# EAGLE design SimuRain_v3.0_SoK (EAGLE 9.4.2)
CHECKED: 5/06/2019; COMPANY: NeKuNeKo Inc. Github: @nekuneko; DATE: $DATE; DRAWN: 1; DRGNO: 1993; REV: 3.0
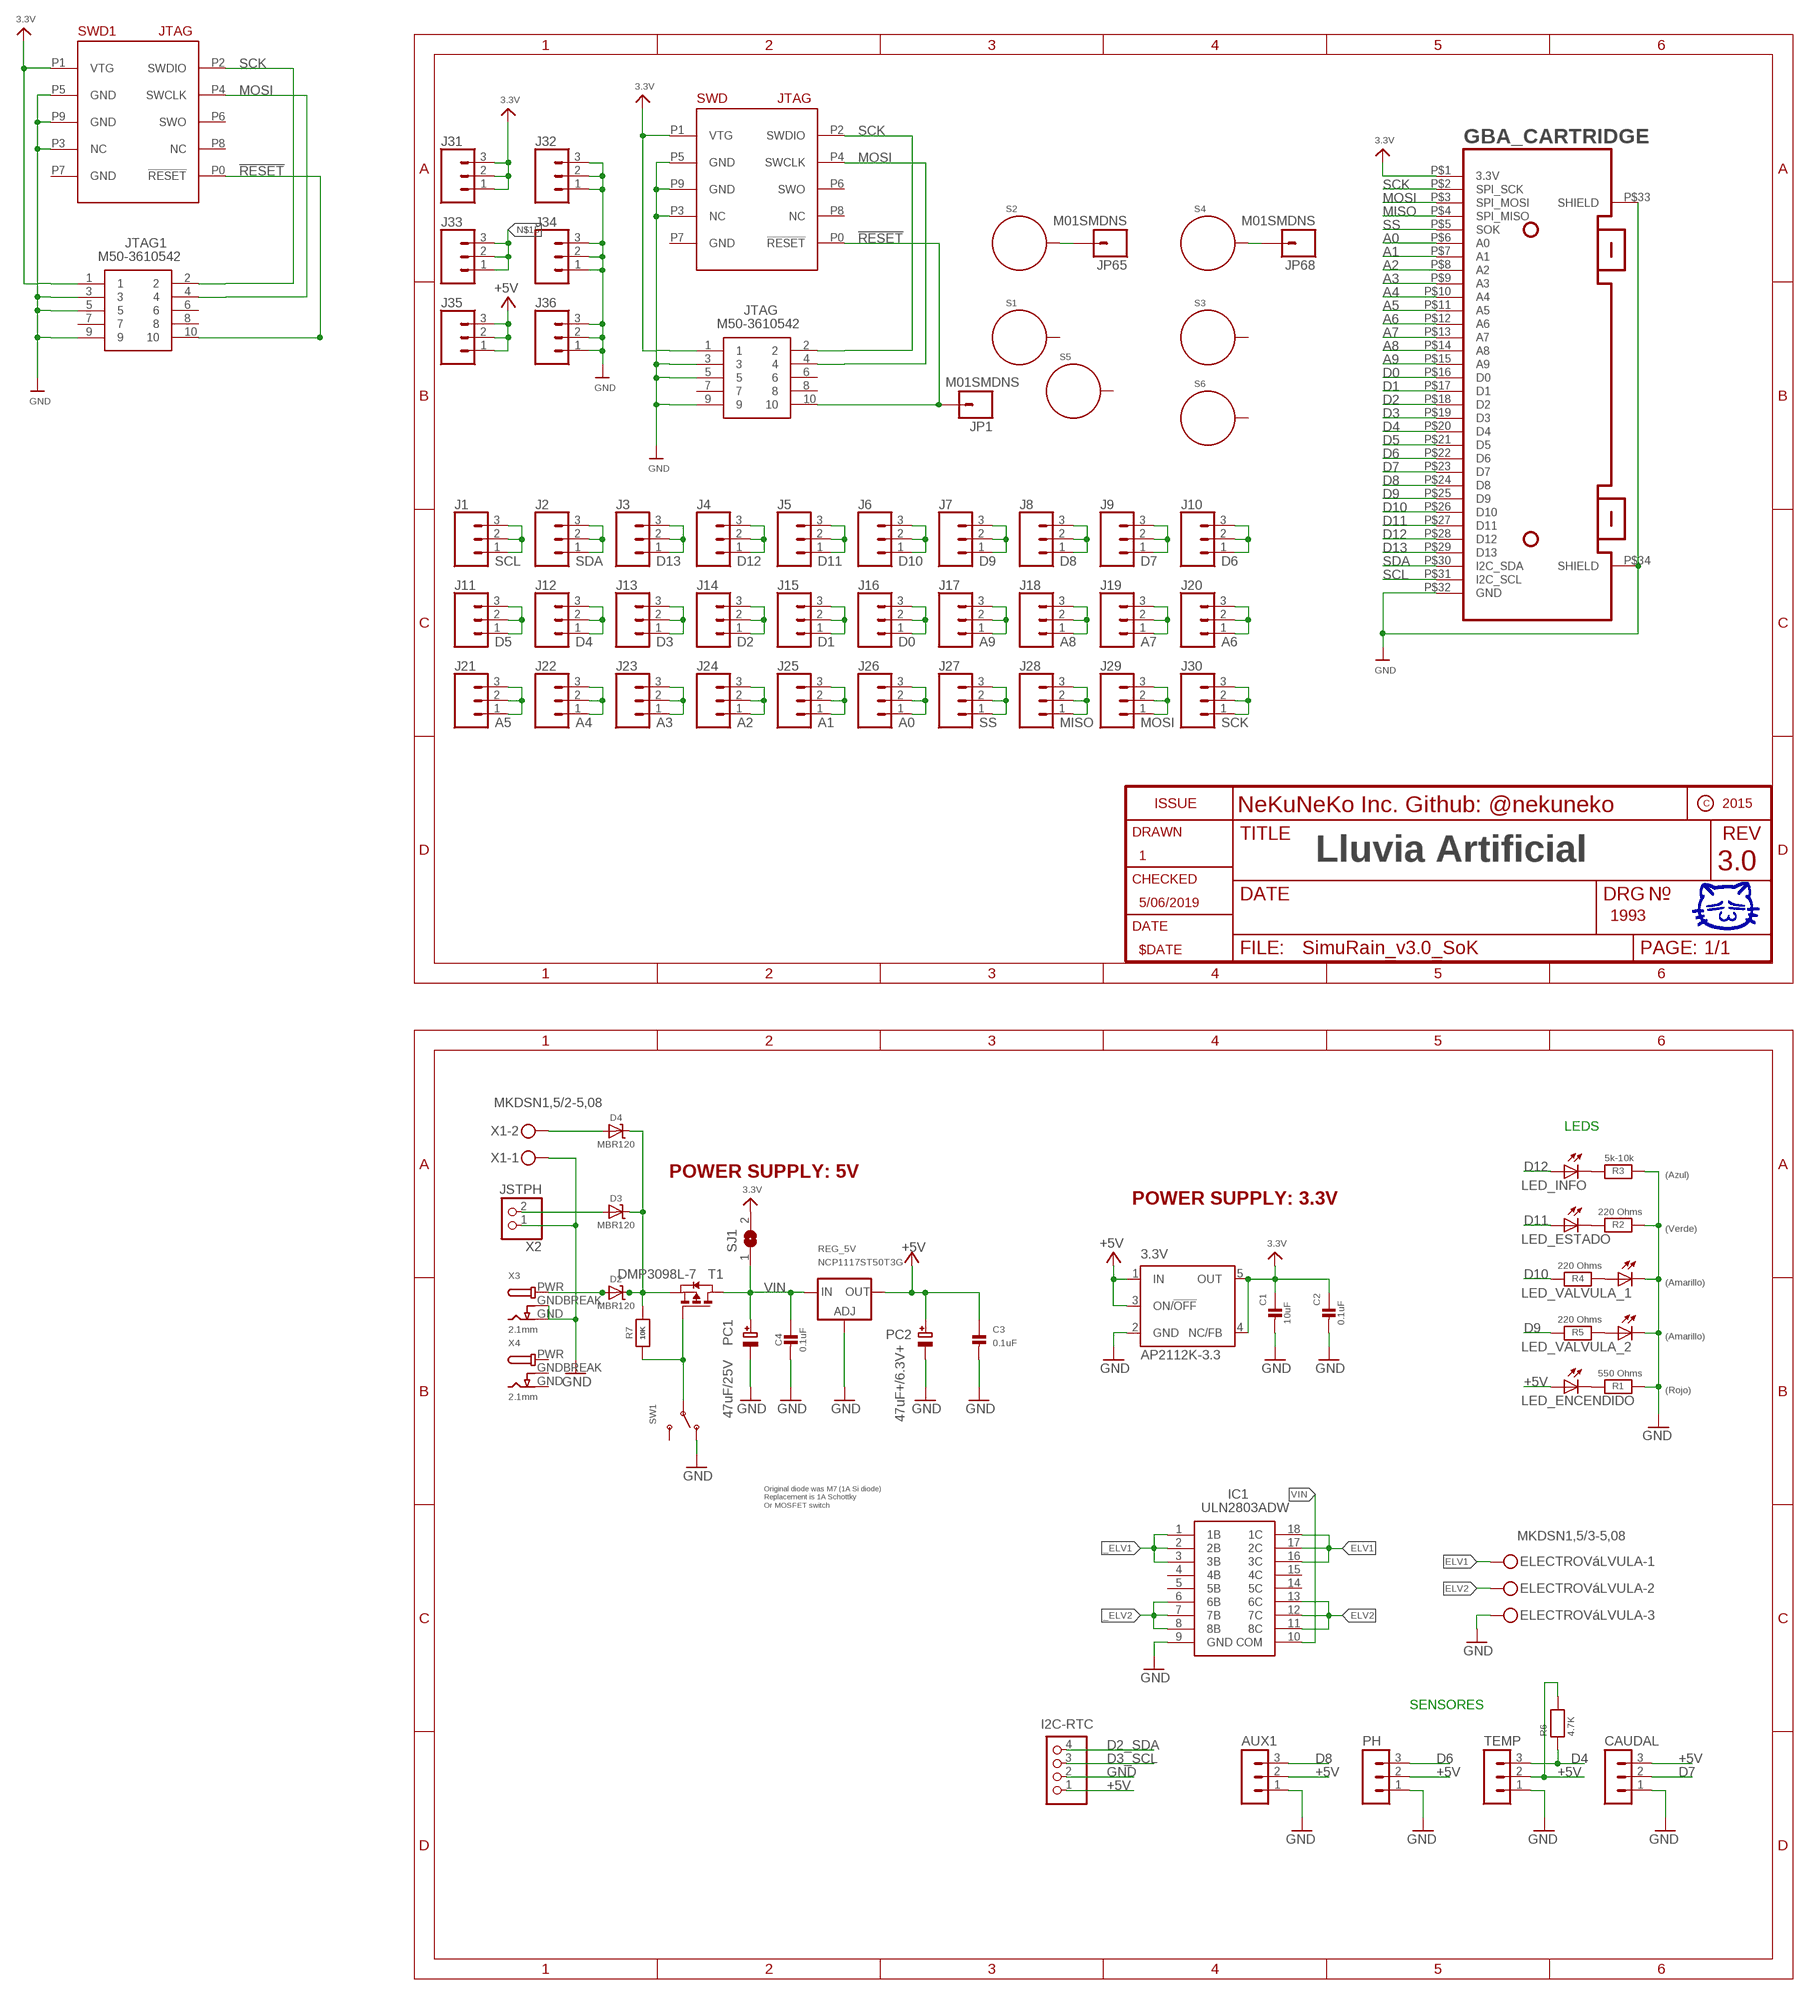
[diagram p0: schematic, sheet 1]

## Parts
3.3V  AP2112K-3.3  LP2985-XXDBVR33  [SOT23-DBV]
AUX1  MA03-1  [MA03-1]
C1  10uF  CAP_CERAMIC_0603  [_0603]
C2  0.1uF  CAP_CERAMIC_0603  [_0603]
C3  0.1uF  CAP_CERAMIC_0603  [_0603]
C4  0.1uF  CAP_CERAMIC_0603  [_0603]
CAUDAL  MA03-1  [MA03-1]
D2  MBR120  DIODE-SCHOTTKYSOD-123  [SOD-123]
D3  MBR120  DIODE-SCHOTTKYSOD-123  [SOD-123]
D4  MBR120  DIODE-SCHOTTKYSOD-123  [SOD-123]
ELECTROVáLVULA  MKDSN1,5/3-5,08  [MKDSN1,5/3-5,08]
GBA_CARTRIDGE  GBA_CARTRIDGEGBA_CARTRIDGE2  [GBA_CARTRIDGE2]
I2C-RTC  HEADER-1X4  [1X04_OVAL]
IC1  ULN2803ADW  [SOIC127P1030X265-18N]
J1  CONN_031X03_NO_SILK  [1X03_NO_SILK]
J2  CONN_031X03_NO_SILK  [1X03_NO_SILK]
J3  CONN_031X03_NO_SILK  [1X03_NO_SILK]
J4  CONN_031X03_NO_SILK  [1X03_NO_SILK]
J5  CONN_031X03_NO_SILK  [1X03_NO_SILK]
J6  CONN_031X03_NO_SILK  [1X03_NO_SILK]
J7  CONN_031X03_NO_SILK  [1X03_NO_SILK]
J8  CONN_031X03_NO_SILK  [1X03_NO_SILK]
J9  CONN_031X03_NO_SILK  [1X03_NO_SILK]
J10  CONN_031X03_NO_SILK  [1X03_NO_SILK]
J11  CONN_031X03_NO_SILK  [1X03_NO_SILK]
J12  CONN_031X03_NO_SILK  [1X03_NO_SILK]
J13  CONN_031X03_NO_SILK  [1X03_NO_SILK]
J14  CONN_031X03_NO_SILK  [1X03_NO_SILK]
J15  CONN_031X03_NO_SILK  [1X03_NO_SILK]
J16  CONN_031X03_NO_SILK  [1X03_NO_SILK]
J17  CONN_031X03_NO_SILK  [1X03_NO_SILK]
J18  CONN_031X03_NO_SILK  [1X03_NO_SILK]
J19  CONN_031X03_NO_SILK  [1X03_NO_SILK]
J20  CONN_031X03_NO_SILK  [1X03_NO_SILK]
J21  CONN_031X03_NO_SILK  [1X03_NO_SILK]
J22  CONN_031X03_NO_SILK  [1X03_NO_SILK]
J23  CONN_031X03_NO_SILK  [1X03_NO_SILK]
J24  CONN_031X03_NO_SILK  [1X03_NO_SILK]
J25  CONN_031X03_NO_SILK  [1X03_NO_SILK]
J26  CONN_031X03_NO_SILK  [1X03_NO_SILK]
J27  CONN_031X03_NO_SILK  [1X03_NO_SILK]
J28  CONN_031X03_NO_SILK  [1X03_NO_SILK]
J29  CONN_031X03_NO_SILK  [1X03_NO_SILK]
J30  CONN_031X03_NO_SILK  [1X03_NO_SILK]
J31  CONN_031X03_NO_SILK  [1X03_NO_SILK]
J32  CONN_031X03_NO_SILK  [1X03_NO_SILK]
J33  CONN_031X03_NO_SILK  [1X03_NO_SILK]
J34  CONN_031X03_NO_SILK  [1X03_NO_SILK]
J35  CONN_031X03_NO_SILK  [1X03_NO_SILK]
J36  CONN_031X03_NO_SILK  [1X03_NO_SILK]
JP1  M01SMDNS  [1X01NS]
JP65  M01SMDNS  [1X01NS]
JP68  M01SMDNS  [1X01NS]
JTAG  M50-3610542  [M503610542]
JTAG1  M50-3610542  [M503610542]
LED_ENCENDIDO  LED5MM  [LED5MM]
LED_ESTADO  LED5MM  [LED5MM]
LED_INFO  LED5MM  [LED5MM]
LED_VALVULA_1  LED5MM  [LED5MM]
LED_VALVULA_2  LED5MM  [LED5MM]
PC1  47uF/25V  CAP_ELECTROLYTICPANASONIC_D  [PANASONIC_D]
PC2  47uF+/6.3V+  CAP_ELECTROLYTICPANASONIC_D  [PANASONIC_D]
PH  MA03-1  [MA03-1]
R1  550 Ohms  RESISTOR_0805  [_0805]
R2  220 Ohms  RESISTOR_0805  [_0805]
R3  5k-10k  RESISTOR_0805  [_0805]
R4  220 Ohms  RESISTOR_0805  [_0805]
R5  220 Ohms  RESISTOR_0805  [_0805]
R6  4.7K  RESISTOR_0805  [_0805]
R7  10K  RESISTOR_0805  [_0805]
REG_5V  NCP1117ST50T3G  LM1117SOT223-REFLOW  [SOT223-R]
S1  STANDOFF_ELECTRICAL  [STANDOFF-ELECTRICAL]
S2  STANDOFF_ELECTRICAL  [STANDOFF-ELECTRICAL]
S3  STANDOFF_ELECTRICAL  [STANDOFF-ELECTRICAL]
S4  STANDOFF_ELECTRICAL  [STANDOFF-ELECTRICAL]
S5  STANDOFF_ELECTRICAL  [STANDOFF-ELECTRICAL]
S6  STANDOFF_ELECTRICAL  [STANDOFF-ELECTRICAL]
SJ1  SOLDERJUMPERREFLOW_NOPASTE  [SOLDERJUMPER_REFLOW_NOPASTE]
SW1  SWITCH_SPDT  [SPDT_SMT_SSSS811101]
SWD  JTAGICE3-CONNECTOR50MIL-THT  [JTAGICE3-50MIL]
SWD1  JTAGICE3-CONNECTOR50MIL-THT  [JTAGICE3-50MIL]
T1  DMP3098L-7  PMOSSOT23  [SOT-23]
TEMP  MA03-1  [MA03-1]
X1  MKDSN1,5/2-5,08  [MKDSN1,5/2-5,08]
X2  JSTPH  CON_JST_PH_2PIN  [JSTPH2]
X3  2.1mm  DCBARRELPTH  [DCJACK_2MM_PTH]
X4  2.1mm  DCBARRELPTH  [DCJACK_2MM_PTH]

## Nets
3.3V: 3.3V.4(NC/FB) 3.3V.5(OUT) C1.1 C2.1 GBA_CARTRIDGE.P$1(3.3V) J31.1 J31.2 J31.3 JTAG1.1 JTAG.1 SJ1.2 SWD1.P1(VTG) SWD.P1(VTG)
!RESET: JP1.1 JTAG1.10 JTAG.10 SWD1.P0(!RESET) SWD.P0(!RESET)
+5V [usbvcc]: 3.3V.1(IN) 3.3V.3(ON/!OFF) AUX1.2 C3.1 CAUDAL.3 I2C-RTC.1 J35.1 J35.2 J35.3 LED_ENCENDIDO.A PC2.+ PH.2 R6.2 REG_5V.2(OUT) REG_5V.4(OUT) TEMP.2
_ELV1: IC1.1(1B) IC1.2(2B) IC1.3(3B)
_ELV2: IC1.6(6B) IC1.7(7B) IC1.8(8B)
A0: GBA_CARTRIDGE.P$6(A0) J26.1 J26.2 J26.3
A1: GBA_CARTRIDGE.P$7(A1) J25.1 J25.2 J25.3
A2: GBA_CARTRIDGE.P$8(A2) J24.1 J24.2 J24.3
A3: GBA_CARTRIDGE.P$9(A3) J23.1 J23.2 J23.3
A4: GBA_CARTRIDGE.P$10(A4) J22.1 J22.2 J22.3
A5: GBA_CARTRIDGE.P$11(A5) J21.1 J21.2 J21.3
A6: GBA_CARTRIDGE.P$12(A6) J20.1 J20.2 J20.3
A7: GBA_CARTRIDGE.P$13(A7) J19.1 J19.2 J19.3
A8: GBA_CARTRIDGE.P$14(A8) J18.1 J18.2 J18.3
A9: GBA_CARTRIDGE.P$15(A9) J17.1 J17.2 J17.3
D0: GBA_CARTRIDGE.P$16(D0) J16.1 J16.2 J16.3
D1: GBA_CARTRIDGE.P$17(D1) J15.1 J15.2 J15.3
D2: GBA_CARTRIDGE.P$18(D2) J14.1 J14.2 J14.3
D2_SDA: I2C-RTC.4
D3: GBA_CARTRIDGE.P$19(D3) J13.1 J13.2 J13.3
D3_SCL: I2C-RTC.3
D4: GBA_CARTRIDGE.P$20(D4) J12.1 J12.2 J12.3 R6.1 TEMP.3
D5: GBA_CARTRIDGE.P$21(D5) J11.1 J11.2 J11.3
D6: GBA_CARTRIDGE.P$22(D6) J10.1 J10.2 J10.3 PH.3
D7: CAUDAL.2 GBA_CARTRIDGE.P$23(D7) J9.1 J9.2 J9.3
D8: AUX1.3 GBA_CARTRIDGE.P$24(D8) J8.1 J8.2 J8.3
D9: GBA_CARTRIDGE.P$25(D9) J7.1 J7.2 J7.3 R5.1
D10: GBA_CARTRIDGE.P$26(D10) J6.1 J6.2 J6.3 R4.1
D11: GBA_CARTRIDGE.P$27(D11) J5.1 J5.2 J5.3 LED_ESTADO.A
D12: GBA_CARTRIDGE.P$28(D12) J4.1 J4.2 J4.3 LED_INFO.A
D13: GBA_CARTRIDGE.P$29(D13) J3.1 J3.2 J3.3
ELV1: ELECTROVáLVULA.1 IC1.16(3C) IC1.17(2C) IC1.18(1C)
ELV2: ELECTROVáLVULA.2 IC1.11(8C) IC1.12(7C) IC1.13(6C)
GND: 3.3V.2(GND) AUX1.1 C1.2 C2.2 C3.2 C4.2 CAUDAL.1 ELECTROVáLVULA.3 GBA_CARTRIDGE.P$32(GND) GBA_CARTRIDGE.P$33(SHIELD) GBA_CARTRIDGE.P$34(SHIELD) I2C-RTC.2 IC1.9(GND) J32.1 J32.2 J32.3 J34.1 J34.2 J34.3 J36.1 J36.2 J36.3 JTAG1.3 JTAG1.5 JTAG1.9 JTAG.3 JTAG.5 JTAG.9 LED_VALVULA_1.K(C) LED_VALVULA_2.K(C) PC1.- PC2.- PH.1 R1.2 R2.2 R3.2 REG_5V.1(ADJ) SW1.A(O) SWD1.P3(NC) SWD1.P5(GND) SWD1.P9(GND) SWD.P3(NC) SWD.P5(GND) SWD.P9(GND) TEMP.1 X1.1 X2.1 X3.GND X3.GNDBREAK
MISO: GBA_CARTRIDGE.P$4(SPI_MISO) J28.1 J28.2 J28.3
MOSI: GBA_CARTRIDGE.P$3(SPI_MOSI) J29.1 J29.2 J29.3 JTAG1.4 JTAG.4 SWD1.P4(SWCLK) SWD.P4(SWCLK)
N$1: D4.A X1.2
N$2: D3.A X2.2
N$4: LED_ENCENDIDO.K(C) R1.1
N$5: LED_ESTADO.K(C) R2.1
N$6: LED_INFO.K(C) R3.1
N$7: LED_VALVULA_2.A R5.2
N$8: LED_VALVULA_1.A R4.2
N$15: D2.C D3.C D4.C J33.1 J33.2 J33.3 R7.2 T1.2(S)
N$65: JP65.1 S2.P1
N$68: JP68.1 S4.P1
PWR_SWITCH: R7.1 SW1.B(P) T1.3(G)
PWRIN [power]: D2.A X3.PWR
SCK: GBA_CARTRIDGE.P$2(SPI_SCK) J30.1 J30.2 J30.3 JTAG1.2 JTAG.2 SWD1.P2(SWDIO) SWD.P2(SWDIO)
SCL: GBA_CARTRIDGE.P$31(I2C_SCL) J1.1 J1.2 J1.3
SDA: GBA_CARTRIDGE.P$30(I2C_SDA) J2.1 J2.2 J2.3
SS: GBA_CARTRIDGE.P$5(SOK) J27.1 J27.2 J27.3
VIN: C4.1 IC1.10(COM) PC1.+ REG_5V.3(IN) SJ1.1 T1.1(D)
Unconnected: IC1.4(4B) IC1.5(5B) IC1.14(5C) IC1.15(4C) JTAG1.6 JTAG1.7 JTAG1.8 JTAG.6 JTAG.7 JTAG.8 S1.P1 S3.P1 S5.P1 S6.P1 SW1.C(S) SWD1.P6(SWO) SWD1.P7(GND) SWD1.P8(NC) SWD.P6(SWO) SWD.P7(GND) SWD.P8(NC)

## Notes on the sheet
- Lluvia Artificial
- LEDS
- POWER SUPPLY: 5V
- (Azul)
- POWER SUPPLY: 3.3V
- (Verde)
- (Amarillo)
- (Amarillo)
- (Rojo)
- Original diode was M7 (1A Si diode)
  Replacement is 1A Schottky
  Or MOSFET switch
- SENSORES

## Power pins joined to a net without a drawn wire
GND: X4.GND
GNDBREAK: X4.GNDBREAK
PWR: X4.PWR

## Library data of the parts
3.3V = SmartPrj:LP2985-XXDBVR: ULTRALOW-POWER 50-mA LOW-DROPOUT LINEAR REGULATORS 50-mA Low-Dropout Regulator Source: http://focus.ti.com/lit/ds/symlink/tps77001.pdf
AUX1 CAUDAL PH TEMP = con-lstb:MA03-1: PIN HEADER; OC_FARNELL: unknown; OC_NEWARK: unknown
C1-C4 = microbuilder:CAP_CERAMIC: Ceramic Capacitors 0402 - 0402 Surface Mount Capacitors 16pF 50V 5% [Digikey: 445-4899-2-ND] 18pF 50V 5% [Digikey: 490-1281-2-ND] 22pF 50V 5% [Digikey: 490-1283-2-ND] 68pF 50V 5% [Digikey: 490-1289-2-ND] 0.1uF 10V 10% [Digikey: 490-1318-2-ND] 1.0uF 6.3V 10% [Digikey: 490-1320-2-ND] 0603 - 0603 Surface Mount Capacitors 16 pF 50V 5% [Digikey: 445-5051-2-ND] 22 pF 50V [Digikey: PCC220ACVTR-ND] 33 pF 50V 5% [Digikey: 490-1415-1-ND] 56pF 50V 5% [Digikey: 490-1421-1-ND] 220pF 50V 5% [Digikey: 445-1285-1-ND] 680 pF 50V 2200 pF 50V 5% C0G [Digikey: 445-1297-1-ND] 5600 pF 100V 5% X7R [Digikey: 478-3711-1-ND] 0.1 µF 25V 10% [Digikey: PCC2277TR-ND] 0.22 µF 16V 10% X7R [Digikey: 445-1318-1-ND] 1.0 µF 25V 10% [Digikey: 445-5146-2-ND] 0603 - RF Specific 3pF 250V +/-0.1pF RF [Digikey: 712-1347-1-ND] 18 pF 250V 5% [Digikey: 478-3505-1-ND or 712-1322-1-ND] 56 pF 250V 5% C0G RF [Digikey: 490-4867-1-ND] 68 pF 250V RF [Digikey: 490-4868-1-ND] 0805 - 0805 Surface Mount Capacitors 220 pF 250V 2% RF Ceramic Capacitor [Digikey: 712-1398-1-ND] 1000 pF 50V 2% NP0 Ceramic Capacitor [Digikey: 478-3760-1-ND] 0.1 µF 25V 10% Ceramic Capacitor [Digikey: PCC1828TR-ND] 1.0 µF 16V 10% Ceramic Capacitor[Digikey: 490-1691-2-ND] 10.0 µF 10V 10% Ceramic Capacitor[Digikey: 709-1228-1-ND] 10.0 uF 16V 10% Ceramic Capacitor [Digikey: 478-5165-2-ND] 47 uF 6.3V 20% Ceramic Capacitor [Digikey: 587-1779-1-ND or 399-5506-1-ND] 1206 - 1206 Surface Mount Capacitors 47uF 10V 20% Ceramic Capacitor [Digikey: 490-5528-1-ND or 399-5508-1-ND or 445-6010-1-ND] 100uF 6.3V -20%, +80% Y5V Ceramic Capacitor (Digikey: 490-4512-1-ND, Mouser: 81-GRM31CF50J107ZE1L)
D2-D4 = microbuilder:DIODE-SCHOTTKY
ELECTROVáLVULA = con-phoenix-508:MKDSN1,5/3-5,08: MKDSN 1,5/ 3-5,08 Printklemme Nennstrom: 13,5 A Nennspannung: 250 V Rastermaß: 5,08 mm Polzahl: 3 Anschlussart: Schraubanschluss Montage: Löten Anschlussrichtung Leiter/Platine: 0 ° Artikelnummer: 1729131 Source: http://eshop.phoenixcontact.com .. 1729131.pdf
GBA_CARTRIDGE = 0SoK:GBA_CARTRIDGE: GBA Cartridge Slot for NDS - from Aliexpress Gontak SoK main interface
I2C-RTC = microbuilder:HEADER-1X4: PIN HEADER
IC1 = SamacSys_Parts:ULN2803ADW: ULN2803ADW, Darlington Transistor Array, NPN 0.5 A 50 V, Octal, 18-Pin, SOIC Source: Datasheet <http://docs-emea.rs-online.com/webdocs/139e/0900766b8139e021.pdf>; DESCRIPTION: ULN2803ADW, Darlington Transistor Array, NPN 0.5 A 50 V, Octal, 18-Pin, SOIC; HEIGHT: 2.65mm; MANUFACTURER_NAME: Texas Instruments; MANUFACTURER_PART_NUMBER: ULN2803ADW; MOUSER_PART_NUMBER: 595-ULN2803ADW; MOUSER_PRICE-STOCK: https://www.mouser.com/Search/Refine.aspx?Keyword=595-ULN2803ADW; RS_PART_NUMBER: 8660196; RS_PRICE-STOCK: http://uk.rs-online.com/web/p/products/8660196
J1-J36 = SparkFun-Connectors:CONN_03: Multi connection point. Often used as Generic Header-pin footprint for 0.1 inch spaced/style header connections On any of the 0.1 inch spaced packages, you can populate with these: Break Away Headers - Straight <https://www.sparkfun.com/products/116> (PRT-00116) Break Away Male Headers - Right Angle <https://www.sparkfun.com/products/553> (PRT-00553) Female Headers <https://www.sparkfun.com/products/115> (PRT-00115) Break Away Headers - Machine Pin <https://www.sparkfun.com/products/117> (PRT-00117) Break Away Female Headers - Swiss Machine Pin <https://www.sparkfun.com/products/743> (PRT-00743) Stackable Header - 3 Pin (Female, 0.1") <https://www.sparkfun.com/products/13875> (PRT-13875) For SCREWTERMINALS and SPRING TERMINALS visit here: Screw Terimnals on SparkFun.com <https://www.sparkfun.com/search/results?term=Screw+Terminals> (5mm/3.5mm/2.54mm spacing) This device is also useful as a general connection point to wire up your design to another part of your project. Our various solder wires solder well into these plated through hole pads. Hook-Up Wire - Assortment (Stranded, 22 AWG) <https://www.sparkfun.com/products/11375> (PRT-11375) Hook-Up Wire - Assortment (Solid Core, 22 AWG) <https://www.sparkfun.com/products/11367> (PRT-11367) View the entire wire category on our website here <https://www.sparkfun.com/categories/141> Special notes: Molex polarized connector foot print use with SKU : PRT-08232 with associated crimp pins and housings.
JP1 JP65 JP68 = SparkFun-Connectors:M01: Header 1 Standard 1-pin 0.1" header. Use with straight break away headers (SKU : PRT-00116), right angle break away headers (PRT-00553), swiss pins (PRT-00743), machine pins (PRT-00117), and female headers (PRT-00115).
JTAG JTAG1 = SamacSys_Parts:M50-3610542: HARWIN - M50-3610542 - CONNECTOR, HEADER, 10POS, 2ROW, 1.27MM Source: Datasheet <https://cdn.harwin.com/pdfs/M50-361.pdf>; DESCRIPTION: HARWIN - M50-3610542 - CONNECTOR, HEADER, 10POS, 2ROW, 1.27MM; HEIGHT: 5.03mm; MANUFACTURER_NAME: HARWIN; MANUFACTURER_PART_NUMBER: M50-3610542; MOUSER_PART_NUMBER: 855-M50-3610542; MOUSER_PRICE-STOCK: https://www.mouser.com/Search/Refine.aspx?Keyword=855-M50-3610542
LED_ENCENDIDO LED_ESTADO LED_INFO LED_VALVULA_1 LED_VALVULA_2 = led:LED: LED OSRAM: - CHIPLED LG R971, LG N971, LY N971, LG Q971, LY Q971, LO R971, LY R971 LH N974, LH R974 LS Q976, LO Q976, LY Q976 LO Q996 - Hyper CHIPLED LW Q18S LB Q993, LB Q99A, LB R99A - SideLED LS A670, LO A670, LY A670, LG A670, LP A670 LB A673, LV A673, LT A673, LW A673 LH A674 LY A675 LS A676, LA A676, LO A676, LY A676, LW A676 LS A679, LY A679, LG A679 - Hyper Micro SIDELED® LS Y876, LA Y876, LO Y876, LY Y876 LT Y87S - SmartLED LW L88C, LW L88S LB L89C, LB L89S, LG L890 LS L89K, LO L89K, LY L89K LS L896, LA L896, LO L896, LY L896 - TOPLED LS T670, LO T670, LY T670, LG T670, LP T670 LSG T670, LSP T670, LSY T670, LOP T670, LYG T670 LG T671, LOG T671, LSG T671 LB T673, LV T673, LT T673, LW T673 LH T674 LS T676, LA T676, LO T676, LY T676, LB T676, LH T676, LSB T676, LW T676 LB T67C, LV T67C, LT T67C, LS T67K, LO T67K, LY T67K, LW E67C LS E67B, LA E67B, LO E67B, LY E67B, LB E67C, LV E67C, LT E67C LW T67C LS T679, LY T679, LG T679 LS T770, LO T770, LY T770, LG T770, LP T770 LB T773, LV T773, LT T773, LW T773 LH T774 LS E675, LA E675, LY E675, LS T675 LS T776, LA T776, LO T776, LY T776, LB T776 LHGB T686 LT T68C, LB T68C - Hyper Mini TOPLED® LB M676 - Mini TOPLED Santana® LG M470 LS M47K, LO M47K, LY M47K Source: http://www.osram.convergy.de LUXEON: - LUMILED® LXK2-PW12-R00, LXK2-PW12-S00, LXK2-PW14-U00, LXK2-PW14-V00 LXK2-PM12-R00, LXK2-PM12-S00, LXK2-PM14-U00 LXK2-PE12-Q00, LXK2-PE12-R00, LXK2-PE12-S00, LXK2-PE14-T00, LXK2-PE14-U00 LXK2-PB12-K00, LXK2-PB12-L00, LXK2-PB12-M00, LXK2-PB14-N00, LXK2-PB14-P00, LXK2-PB14-Q00 LXK2-PR12-L00, LXK2-PR12-M00, LXK2-PR14-Q00, LXK2-PR14-R00 LXK2-PD12-Q00, LXK2-PD12-R00, LXK2-PD12-S00 LXK2-PH12-R00, LXK2-PH12-S00 LXK2-PL12-P00, LXK2-PL12-Q00, LXK2-PL12-R00 Source: www.luxeon.com KINGBRIGHT: KA-3528ASYC Source: www.kingbright.com
PC1 PC2 = microbuilder:CAP_ELECTROLYTIC: Electrolytic Capacitors SMT PANASONIC_C - Size C Panasonic Electrolytic Aluminum Capacitor 47µF 16V 20% Electrolytic Capacitor [Digikey: PCE3890TR-ND] PANASONIC_D - Size D Panasonic Electrolytic Aluminum Capacitor 100µF 25V 20% Electrolytic Capacitor [Digikey: PCE3898TR-ND] PTH 3.5 mm grid, 8 mm diameter ... 3.5 mm grid, 10 mm diameter ...
R1-R7 = microbuilder:RESISTOR: Resistors 0402 - 0402 Surface Mount Package 22 Ohm 1% 1/16W [Digikey: 311-22.0LRTR-ND] 33 Ohm 5% 1/16W 1.0K 5% 1/16W 1.5K 5% 1/16W 2.0K 1% 1/16W 10.0K 1% 1/16W [Digikey: 311-10.0KLRTR-ND] 10.0K 5% 1/16W [Digikey: RMCF0402JT10K0TR-ND] 12.1K 1% 1/16W [Digikey: 311-22.0LRTR-ND] 100.0K 5% 1/16W 0603 - 0603 Surface Mount Package 0 Ohm 1/10 Watt 1% Resistor 15 Ohm 1/10 Watt 1% Resistor 33 Ohm 1/10 Watt 1% Resistor 49.9 Ohm 1/10 Watt 1% Resistor 100 Ohm 1/10 Watt 1% Resistor 150 Ohm 1/10 Watt 1% Resistor 240 Ohm 1/10 Watt 1% Resistor 390 Ohm 1/10 Watt 1% Resistor 560 Ohm 1/10 Watt 1% Resistor 680 Ohm 1/10 Watt 1% Resistor 750 Ohm 1/10 Watt 1% Resistor 1.0K Ohm 1/10 Watt 1% Resistor 1.5K Ohm 1/10 Watt 1% Resistor 2.0K Ohm 1/10 Watt 1% Resistor 2.2K Ohm 1/10 Watt 1% Resistor 3.3K Ohm 1/10 Watt 1% Resistor 4.7K Ohm 1/10 Watt 1% Resistor 10.0K Ohm 1/10 Watt 1% Resistor 12.0K Ohm 1/10 Watt 1% Resistor 12.1K Ohm 1/10 Watt 1% Resistor 20.0K Ohm 1/10 Watt 1% Resistor 33.0K Ohm 1/10 Watt 1% Resistor 100.0K Ohm 1/10 Watt 1% Resistor 0805 - 0805 Surface Mount Package 0 Ohm 1/8 Watt 1% Resistor 33 Ohm 1/8 Watt 1% Resistor 100 Ohm 1/8 Watt 1% Resistor 150 Ohm 1/8 Watt 1% Resistor 200 Ohm 1/8 Watt 1% Resistor 240 Ohm 1/8 Watt 1% Resistor 330 Ohm 1/8 Watt 1% Resistor 390 Ohm 1/8 Watt 1% Resistor 470 Ohm 1/8 Watt 1% Resistor 1.0K Ohm 1/8 Watt 1% Resistor 1.5K Ohm 1/8 Watt 1% Resistor 2.0K Ohm 1/8 Watt 1% Resistor 4.7K Ohm 1/8 Watt 1% Resistor 5.1K Ohm 1/8 Watt 1% Resistor 5.6K Ohm 1/8 Watt 1% Resistor 10.0K Ohm 1/8 Watt 1% Resistor 22.0K Ohm 1/8 Watt 1% Resistor 33.0K Ohm 1/8 Watt 1% Resistor 100K Ohm 1/8 Watt 1% Resistor 1206 - 1206 Surface Mount Package 2012 - 2010 Surface Mount Package 0.11 Ohm 1/2 Watt 1% Resistor - Digikey: RHM.11UCT-ND
REG_5V = microbuilder:LM1117: LM1117 Voltage Regulator LM1117 Adjustable Voltage regulator [Digikey: LM1117IMP-ADJDKR-ND] LM1117 3.3V Voltage regulator [AP1117E33GDIDKR-ND] LM1117 5.0V Voltage regulator [AP1117E50GDIDKR-ND] SOT223-REFLOW - SOT223 package for solder paste/reflow ovens SOT223-WAVE - SOT223 package for hand-soldering (larger pads) Note: For the fixed-voltage regulators, simply set the ADJ pin to GND.
S1-S6 = SparkFun-Electromechanical:STANDOFF_ELECTRICAL: A standoff intended to be an electrically connected point. Pad size and stop size allow for a #4 Phillips pan screw head to make a solid connection to the board.
SJ1 = microbuilder:SOLDERJUMPER: SMD Solder JUMPER Solder the two pads together to create a connection, or remove the solder to break it. REFLOW - Use this footprint for solder paste and reflow ovens. WAVE - Use this footprint for hand-soldering (larger pads). CLOSED - Has a trace between the two pads to ensure it is closed by default. The trace needs to be cut to disable the jumper, and can be closed again by creating a solder bridge between the two pads.
SW1 = microbuilder:SWITCH_SPDT: Switch - SPDT SSSS811101 - Horizontal Two Position SMT, 0.3A 4V [Mouser: 688-SSSS811101]
SWD SWD1 = 0SoK:JTAGICE3-CONNECTOR: JTAG Connector for JTAGICE3 Designed originally by Michael Hohl <https://www.michaelhohl.net/> in May 2013. Edit in August 2018 by NekuNeko <https://github.com/nekuneko//>. You are free to use, edit and distribute this library.
T1 = zetex:PMOSSOT23: MOS FET; OC_FARNELL: unknown; OC_NEWARK: unknown
X1 = con-phoenix-508:MKDSN1,5/2-5,08: MKDSN 1,5/ 2-5,08 Printklemme Nennstrom: 13,5 A Nennspannung: 250 V Rastermaß: 5,08 mm Polzahl: 2 Anschlussart: Schraubanschluss Montage: Löten Anschlussrichtung Leiter/Platine: 0 ° Artikelnummer: 1729128 Source: http://eshop.phoenixcontact.com .. 1729128.pdf
X2 = microbuilder:CON_JST_PH_2PIN: JST 2-Pin Right-Angle Connector PH-Series - 4UConnector: 17311 SH-Series - 4UConnector: 07278
X3 X4 = microbuilder:DCBARREL: DC Barrel Jack DCJACK_1.3MM_PTH - Through Hole 1.3mm Jack (4UConnector: 05536) DCJACK_2MM_PTH - Through Hole 2.0/2.1 Jack (4UConnector: 05537) DCJACK_2MM_SMT - SMT 2.0/2.1mm Jack(4UConnector: 03267)

## Net classes
1 power: width 0.305 mm
2 gnd: width 0.254 mm

## Board
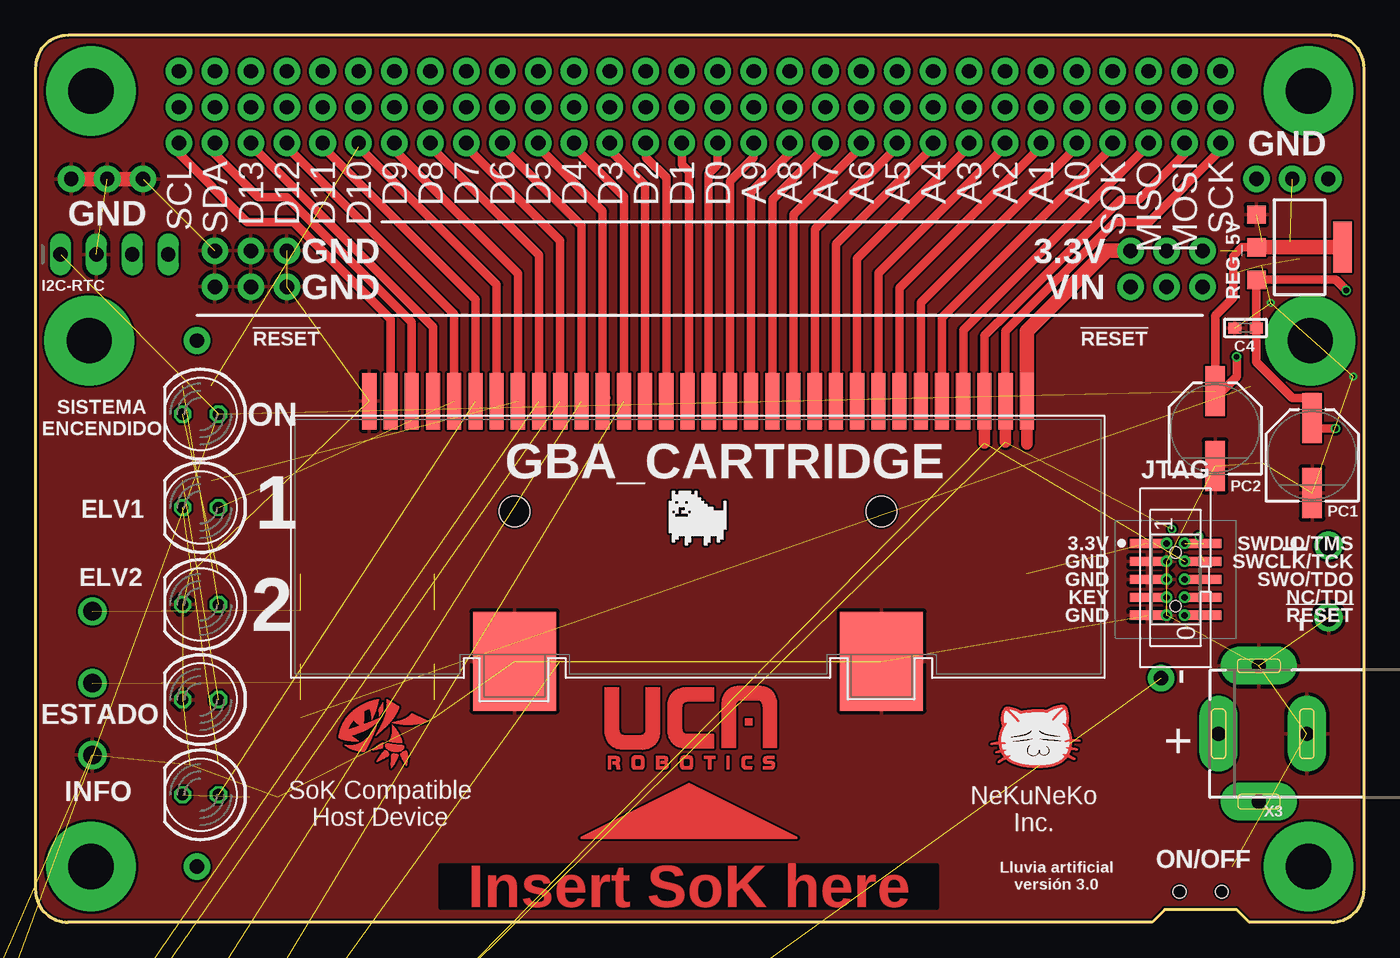
[diagram p1: board, top side]
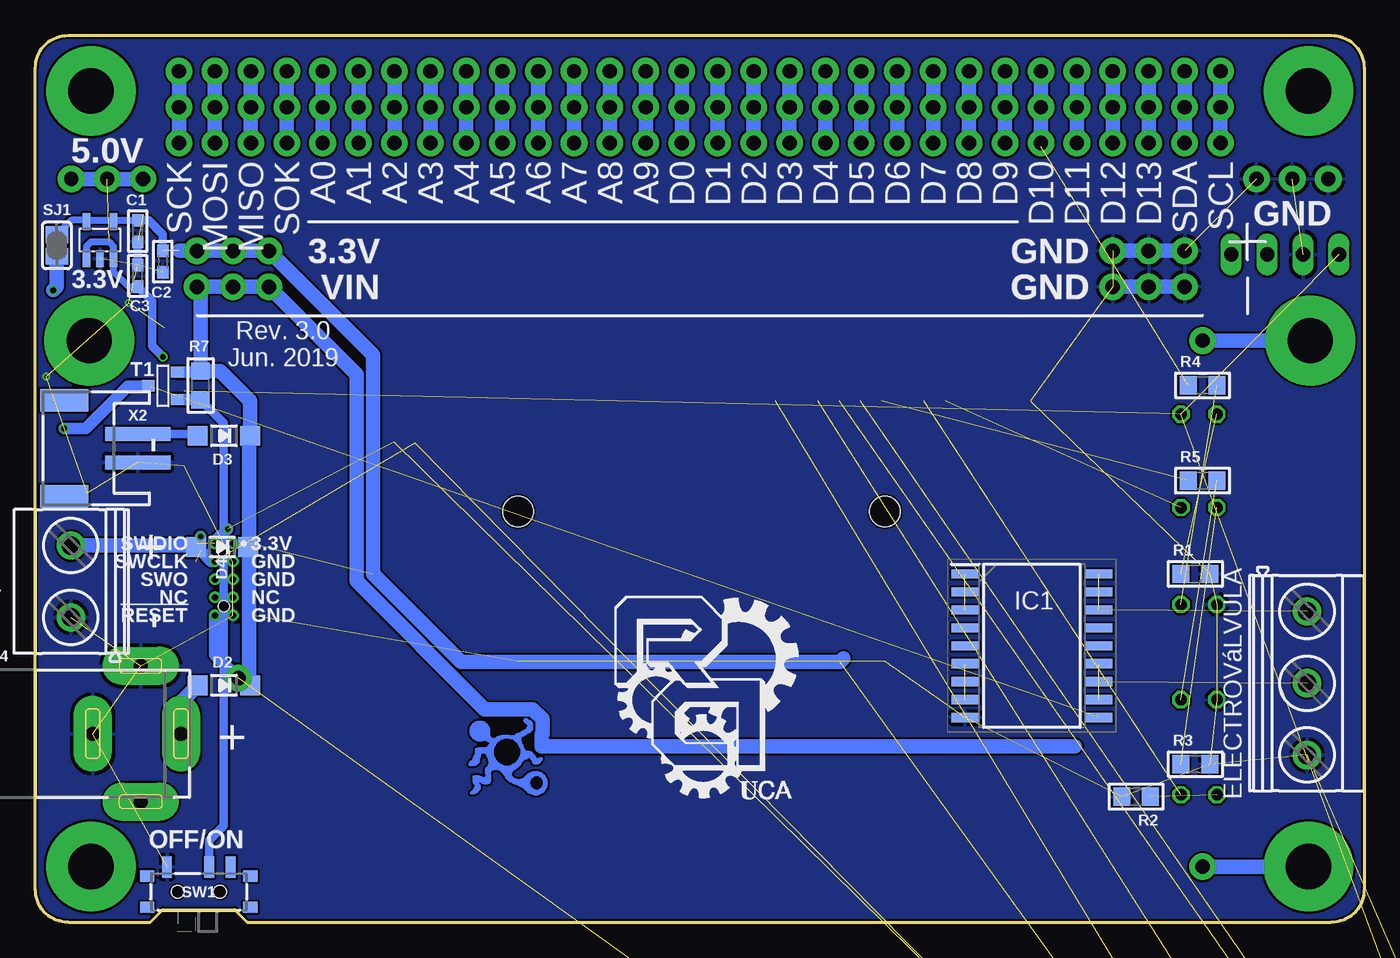
[diagram p2: board, bottom side, seen from below]

Size 93.98 x 62.74 mm. Coordinates in mm from the lower left corner, seen from the top.
Outline: 93.98,2.32 93.98,60.42 arc90 91.66,62.74 2.32,62.74 arc90 0,60.42 0,2.32 arc90 2.32,0 78.99,0 79.88,0.89 84.96,0.89 85.85,0 91.66,0 arc90 93.98,2.32
Copper layers (1*16): Top 0.035559375mm / dielectric 1.6mm / Bottom 0.035559375mm
Design rules "nekuneko": minimum track width 6mil, minimum drill 0.3mm, track to track 6mil, track to pad 6mil, pad to pad 6mil, via to via 6mil, smd to smd 6mil, copper to edge 6mil, drill to drill 6mil, minimum pad ring 5mil, minimum via ring 5mil, stop-mask expansion 2.5mil, vias tented up to drill 0mil, thermal gap 10mil

### Footprints (pad centres in the part's own frame; a part is rotated, then mirrored left to right if it is on the bottom)
SOT23-DBV = smd 0.55 x 1.2: 1 -0.95,-1.3; 2 0,-1.3; 3 0.95,-1.3; 4 0.95,1.3; 5 -0.95,1.3
MA03-1 = drill 1.016 long: 1 -2.54,0; 2 0,0; 3 2.54,0
_0603 = smd 0.9 x 0.8: 1 -0.762,0; 2 0.762,0
SOD-123 = smd 1.4 x 1.4: A 1.85,0; C -1.85,0
MKDSN1,5/3-5,08 = drill 1.3 pad 2: 1 -7.641,0.025; 2 -2.561,0.025; 3 2.519,0.025
GBA_CARTRIDGE2 = smd 1 x 4: P$1 5.25,-1.3; P$2 6.75,-1.3; P$3 8.25,-1.3; P$4 9.75,-1.3; P$5 11.25,-1.3; P$6 12.75,-1.3; P$7 14.25,-1.3; P$8 15.75,-1.3; P$9 17.25,-1.3; P$10 18.75,-1.3; P$11 20.25,-1.3; P$12 21.75,-1.3; P$13 23.25,-1.3; P$14 24.75,-1.3; P$15 26.25,-1.3; P$16 27.75,-1.3; P$17 29.25,-1.3; P$18 30.75,-1.3; P$19 32.25,-1.3; P$20 33.75,-1.3; P$21 35.25,-1.3; P$22 36.75,-1.3; P$23 38.25,-1.3; P$24 39.75,-1.3; P$25 41.25,-1.3; P$26 42.75,-1.3; P$27 44.25,-1.3; P$28 45.75,-1.3; P$29 47.25,-1.3; P$30 48.75,-1.3; P$31 50.25,-1.3; P$32 51.75,-1.3 | smd 5.88 x 7: P$33 15.525,17.1; P$34 41.475,17.1 | hole 2.159: 41.475,6.504; 15.525,6.504
1X04_OVAL = drill 1 long: 1 -3.81,0; 2 -1.27,0; 3 1.27,0; 4 3.81,0
SOIC127P1030X265-18N = smd 1.95 x 0.65: 1 -4.725,5.08; 2 -4.725,3.81; 3 -4.725,2.54; 4 -4.725,1.27; 5 -4.725,0; 6 -4.725,-1.27; 7 -4.725,-2.54; 8 -4.725,-3.81; 9 -4.725,-5.08; 10 4.725,-5.08; 11 4.725,-3.81; 12 4.725,-2.54; 13 4.725,-1.27; 14 4.725,0; 15 4.725,1.27; 16 4.725,2.54; 17 4.725,3.81; 18 4.725,5.08
1X03_NO_SILK = drill 1.016 pad 1.88: 1 0,0; 2 2.54,0; 3 5.08,0
1X01NS = drill 1.016 pad 1.88: 1 0,0
M503610542 = smd 0.65 x 2.5: 1 -2.54,-2; 2 -2.54,2; 3 -1.27,-2; 4 -1.27,2; 5 0,-2; 6 0,2; 7 1.27,-2; 8 1.27,2; 9 2.54,-2; 10 2.54,2 | hole 0.8: -1.905,0; 1.905,0
LED5MM = drill 0.813 octagon: A -1.27,0; K 1.27,0
PANASONIC_D = smd 3.556 x 1.4: + 2.654,0; - -2.654,0
_0805 = smd 1.2 x 1.3: 1 -1.016,0; 2 1.016,0
SOT223-R = smd 1.3 x 1.3: 1 -2.3,-3.05; 2 0,-3.05; 3 2.3,-3.05 | smd 3.6 x 1.3: 4 0,3.05
STANDOFF-ELECTRICAL = drill 3.2 pad 6.35: P1 0,0
SOLDERJUMPER_REFLOW_NOPASTE = smd 1.168 x 1.6: 1 -0.762,0; 2 0.762,0
SPDT_SMT_SSSS811101 = smd 0.7 x 1.5: A -2.25,1.75; B 0.75,1.75; C 2.25,1.75 | smd 1 x 0.8: SUP1 -3.65,1.1; SUP2 -3.65,-1.1; SUP3 3.65,1.1; SUP4 3.65,-1.1 | hole 0.9: -1.5,0; 1.5,0
JTAGICE3-50MIL = drill 0.432 pad 0.813: P0 -2.54,-0.635; P1 2.54,0.635; P2 2.54,-0.635; P3 1.27,0.635; P4 1.27,-0.635; P5 0,0.635; P6 0,-0.635; P7 -1.27,0.635; P8 -1.27,-0.635; P9 -2.54,0.635
SOT-23 = smd 0.787 x 0.889: 1 0.025,-1.016; 2 -0.94,1.016; 3 0.991,1.016
MKDSN1,5/2-5,08 = drill 1.3 pad 2: 1 -2.561,0.025; 2 2.519,0.025
JSTPH2 = smd 1 x 4.6: 1 -1,-3.7; 2 1,-3.7 | smd 1.6 x 3.4: NC1 -3.4,1.5; NC2 3.4,1.5
DCJACK_2MM_PTH = drill 1 pad 2.7 long: GND 7.35,0; GNDBREAK 10.75,-4.8; PWR 13.6,0

### Placement (x,y rotation side)
3.3V  89.41,48.26 0 bottom
AUX1  -9.27,-24.51 0 top  (outside the outline)
C1  86.74,48.9 270 bottom
C2  84.96,46.74 270 bottom
C3  86.74,45.72 90 bottom
C4  85.6,42.04 180 top
CAUDAL  -9.27,-29.59 0 top  (outside the outline)
D2  80.64,16.76 180 bottom
D3  80.64,34.42 180 bottom
D4  80.77,26.54 180 bottom
ELECTROVáLVULA  4.06,14.35 270 bottom
GBA_CARTRIDGE  75.37,35.56 180 top
I2C-RTC  5.59,47.24 0 top
IC1  23.5,19.56 0 bottom
J1  10.16,60.2 270 bottom
J2  12.7,60.2 270 bottom
J3  15.24,60.2 270 bottom
J4  17.78,60.2 270 bottom
J5  20.32,60.2 270 bottom
J6  22.86,60.2 270 bottom
J7  25.4,60.2 270 bottom
J8  27.94,60.2 270 bottom
J9  30.48,60.2 270 bottom
J10  33.02,60.2 270 bottom
J11  35.56,60.2 270 bottom
J12  38.1,60.2 270 bottom
J13  40.64,60.2 270 bottom
J14  43.18,60.2 270 bottom
J15  45.72,60.2 270 bottom
J16  48.26,60.2 270 bottom
J17  50.8,60.2 270 bottom
J18  53.34,60.2 270 bottom
J19  55.88,60.2 270 bottom
J20  58.42,60.2 270 bottom
J21  60.96,60.2 270 bottom
J22  63.5,60.2 270 bottom
J23  66.04,60.2 270 bottom
J24  68.58,60.2 270 bottom
J25  71.12,60.2 270 bottom
J26  73.66,60.2 270 bottom
J27  76.2,60.2 270 bottom
J28  78.74,60.2 270 bottom
J29  81.28,60.2 270 bottom
J30  83.82,60.2 270 bottom
J31  77.47,47.5 180 bottom
J32  12.7,47.5 180 bottom
J33  77.47,44.96 180 bottom
J34  12.7,44.96 180 bottom
J35  91.44,52.58 180 top
J36  7.62,52.58 180 top
JP1  79.63,17.27 180 top
JP65  11.43,41.15 180 top
JP68  11.43,3.94 180 top
JTAG  80.64,24.26 270 top
JTAG1  -8,-45.72 0 top  (outside the outline)
LED_ENCENDIDO  11.68,35.94 180 top
LED_ESTADO  11.68,9.02 180 top
LED_INFO  11.68,29.34 180 top
LED_VALVULA_1  11.68,22.48 180 top
LED_VALVULA_2  11.68,15.75 180 top
PC1  90.3,33.02 90 top
PC2  83.44,34.92 90 top
PH  -9.27,-34.67 0 top  (outside the outline)
R1  11.94,24.64 0 bottom
R2  16.13,8.89 180 bottom
R3  11.94,11.18 0 bottom
R4  11.43,37.97 0 bottom
R5  11.43,31.24 0 bottom
R6  -3.17,-38.86 0 top  (outside the outline)
R7  82.3,37.97 90 bottom
REG_5V  89.41,47.75 270 top
S1  90.17,41.15 180 top
S2  3.81,41.15 180 top
S3  90.04,3.94 180 top
S4  3.94,3.94 180 top
S5  90.04,58.8 180 top
S6  3.94,58.8 180 top
SJ1  92.46,47.88 90 bottom
SW1  82.42,2.16 0 bottom
SWD  80.64,24.26 90 top
SWD1  -8.51,-52.7 0 top  (outside the outline)
T1  84.96,37.97 270 bottom
TEMP  -9.27,-39.75 0 top  (outside the outline)
U$1  [NEKO_6_5_BORDE_TPLACE]  67.56,10.92 0 top
U$2  [DOG]  44.58,26.42 0 top
U$3  [SOK_FINISH]  21.34,10.67 0 top
U$9  [GIRA]  53.21,8.51 0 bottom
U$10  [UCAROBOTICS]  40.01,10.54 0 top
U$15  [BUGS_6]  57.53,14.61 180 bottom
U$50  [TRIANGLE]  46.23,9.78 270 top
X1  91.44,24.13 90 bottom
X2  90.42,33.53 90 bottom
X3  97.28,13.34 180 top
X4  97.28,13.34 0 bottom

### Tracks (layer width: path | path; a pad name or v marks a point on that pad's centre or on a via)
3.3V  (4 unrouted)
  Top 0.508: SWD.P1 JTAG.1
  Top 0.813: GBA_CARTRIDGE.P$1 70.12,33.83
  Top 1.016: GBA_CARTRIDGE.P$1 70.12,41.83 75.79,47.5 J31.1
  Bottom 0.508: 3.3V.5 90.45,49.66 91.44,49.66 SJ1.2 | 3.3V.5 90.26,49.66 | C1.1 88.36,49.66 3.3V.4 88.56,49.66 90.26,49.66 | 3.3V.5 90.26,49.66
  Bottom 0.61: C2.1 84.96,48.64 85.98,49.66 C1.1
  Bottom 1.016: 83.82,47.5 J31.3 J31.2 J31.1 70.1,40.13 70.1,24.64 63.88,18.41 37.08,18.41 36.83,18.67
!RESET  (2 unrouted)
  Top 0.508: SWD.P0 JTAG.10
  Bottom 0.813: SWD.P0 81.28,18.92 JP1.1
+5V  (via drill 0.4)  (8 unrouted)
  Top 0.61: REG_5V.2 85.34,47.75 84.71,47.12 84.71,44.2 83.44,42.93 PC2.+ 83.93,37.58 84.96,38.61 v84.96,40.01
  Top 1.016: REG_5V.2 REG_5V.4 | 83.44,38.85 PC2.+
  Bottom 0.508: C3.1 87.38,44.96 88.46,46.04 3.3V.3 88.46,47.82 88.77,48.13 90.04,48.13 90.36,47.82 3.3V.1
  Bottom 0.61: v84.96,40.01 85.72,40.77 85.72,43.94 C3.1
  Bottom 1.016: J35.1 J35.2 J35.3
_ELV1  (2 unrouted)
_ELV2  (2 unrouted)
A0
  Top 0.61: GBA_CARTRIDGE.P$6 62.62,43.83 73.66,54.86 J26.3
  Bottom 1.016: J26.1 J26.2 J26.3
A1
  Top 0.61: GBA_CARTRIDGE.P$7 61.12,44.87 71.12,54.86 J25.3
  Bottom 1.016: J25.1 J25.2 J25.3
A2
  Top 0.61: GBA_CARTRIDGE.P$8 59.62,45.91 68.58,54.86 J24.3
  Bottom 1.016: J24.1 J24.2 J24.3
A3
  Top 0.61: GBA_CARTRIDGE.P$9 58.12,46.95 66.04,54.86 J23.3
  Bottom 1.016: J23.3 J23.2 J23.1
A4
  Top 0.61: GBA_CARTRIDGE.P$10 56.62,47.99 63.5,54.86 J22.3
  Bottom 1.016: J22.1 J22.2 J22.3
A5
  Top 0.61: GBA_CARTRIDGE.P$11 55.12,49.03 60.96,54.86 J21.3
  Bottom 1.016: J21.3 J21.2 J21.1
A6
  Top 0.61: GBA_CARTRIDGE.P$12 53.62,50.07 58.42,54.86 J20.3
  Bottom 1.016: J20.1 J20.2 J20.3
A7
  Top 0.61: GBA_CARTRIDGE.P$13 52.12,51.11 55.88,54.86 J19.3
  Bottom 1.016: J19.3 J19.2 J19.1
A8
  Top 0.508: 50.67,36.88 GBA_CARTRIDGE.P$14
  Top 0.61: GBA_CARTRIDGE.P$14 50.62,51.64 53.34,54.36 J18.3
  Bottom 1.016: J18.1 J18.2 J18.3
A9
  Top 0.61: GBA_CARTRIDGE.P$15 49.12,52.42 50.8,54.1 J17.3
  Bottom 1.016: J17.3 J17.2 J17.1
D0
  Top 0.508: 47.62,36.92 GBA_CARTRIDGE.P$16
  Top 0.61: GBA_CARTRIDGE.P$16 47.62,52.96 48.26,53.59 J16.3
  Bottom 1.016: J16.1 J16.2 J16.3
D1
  Top 0.61: GBA_CARTRIDGE.P$17 46.23,36.97 46.23,53.09 45.72,53.59 J15.3
  Bottom 1.016: J15.3 J15.2 J15.1
D2
  Top 0.61: GBA_CARTRIDGE.P$18 44.62,52.66 43.18,54.1 J14.3
  Bottom 1.016: J14.1 J14.2 J14.3
D3
  Top 0.61: GBA_CARTRIDGE.P$19 43.12,52.13 40.64,54.61 J13.3
  Bottom 1.016: J13.3 J13.2 J13.1
D4  (2 unrouted)
  Top 0.61: GBA_CARTRIDGE.P$20 41.62,51.34 38.1,54.86 J12.3
  Bottom 1.016: J12.1 J12.2 J12.3
D5
  Top 0.508: 40.44,37.11 GBA_CARTRIDGE.P$21
  Top 0.61: GBA_CARTRIDGE.P$21 40.12,50.3 35.56,54.86 J11.3
  Bottom 1.016: J11.1 J11.2 J11.3
D6  (1 unrouted)
  Top 0.61: GBA_CARTRIDGE.P$22 38.62,49.26 33.02,54.86 J10.3
  Bottom 1.016: J10.1 J10.2 J10.3
D7  (1 unrouted)
  Top 0.61: GBA_CARTRIDGE.P$23 37.12,48.22 30.48,54.86 J9.3
  Bottom 1.016: J9.1 J9.2 J9.3
D8  (1 unrouted)
  Top 0.61: GBA_CARTRIDGE.P$24 35.62,47.18 27.94,54.86 J8.3
  Bottom 1.016: J8.1 J8.2 J8.3
D9  (1 unrouted)
  Top 0.61: GBA_CARTRIDGE.P$25 34.12,45.89 25.4,54.61 J7.3
  Bottom 1.016: J7.1 J7.2 J7.3
D10  (1 unrouted)
  Top 0.61: GBA_CARTRIDGE.P$26 32.62,45.1 22.86,54.86 J6.3
  Bottom 1.016: J6.1 J6.2 J6.3
D11  (1 unrouted)
  Top 0.61: GBA_CARTRIDGE.P$27 31.12,44.06 20.32,54.86 J5.3
  Bottom 1.016: J5.1 J5.2 J5.3
D12  (1 unrouted)
  Top 0.61: J4.3 17.78,54.87 29.62,43.02 GBA_CARTRIDGE.P$28
  Bottom 1.016: J4.1 J4.2 J4.3
D13
  Top 0.61: GBA_CARTRIDGE.P$29 28.12,42.11 15.24,54.99 J3.3
  Bottom 1.016: J3.1 J3.2 J3.3
ELV1  (3 unrouted)
ELV2  (3 unrouted)
GND  (via drill 0.3)  (40 unrouted)
  Top 0.508: SWD.P3 JTAG.3 | SWD.P5 JTAG.5 | SWD.P9 JTAG.9
  Top 1.016: J36.3 J36.2 J36.1
  Bottom 0.61: C3.2 C1.2
  Bottom 1.016: J32.3 J32.2 J32.1 | J34.3 J34.2 J34.1
  other vias: 87.38,43.81 93.22,38.61
  pour Top (isolate 0.012): 93.98,0 93.98,62.74 93.73,62.74 0,62.74 0,0
  pour Bottom: 93.98,62.74 0,62.74 0,0 93.98,0
MISO
  Top 0.61: GBA_CARTRIDGE.P$4 65.62,41.87 78.74,54.99 J28.3
  Bottom 1.016: J28.1 J28.2 J28.3
MOSI  (via drill 0.35)  (4 unrouted)
  Top 0.61: 67.12,41.5 GBA_CARTRIDGE.P$3 67.12,41.5 | 67.12,41.5 68.04,42.42 68.07,42.42 76.78,51.13 78.05,51.13 81.28,54.36 J29.3
  Top 0.813: GBA_CARTRIDGE.P$3 67.12,33.9
  Bottom 0.813: SWD.P4 81.53,25.53 82.3,26.29 v82.3,27.3
  Bottom 1.016: J29.1 J29.2 J29.3
N$1
  Bottom 1.016: X1.2 82.62,26.65 D4.A
N$2
  Bottom 0.61: D3.A 82.61,34.53 X2.2
N$4  (1 unrouted)
N$5  (1 unrouted)
N$6  (1 unrouted)
N$7  (1 unrouted)
N$8  (1 unrouted)
N$15
  Bottom 0.61: R7.2 82.17,38.73
  Bottom 0.813: R7.2 82.37,38.91 T1.2
  Bottom 1.016: 78.87,26.54 78.87,16.84 D2.C 78.74,16.76 | 78.87,26.54 78.87,34.42 D3.C 78.8,36.88 80.9,38.99 R7.2 82.3,44.7 J33.3 J33.2 J33.1 71.27,38.76 71.27,24.15 62.19,15.07 58.8,15.07 58.12,14.39 58.12,13.34 58.19,13.26 58.19,12.45 20.45,12.45 | D4.C 78.87,26.54
N$65
  Bottom 1.016: JP65.1 S2.P1
N$68
  Bottom 1.016: S4.P1 JP68.1
PWR_SWITCH
  Bottom 0.61: SW1.B 81.67,5.81 80.66,6.83 80.66,35.32 R7.1
  Bottom 0.813: T1.3 82.32,36.98 R7.1
PWRIN
  Bottom 1.016: D2.A 83.68,15.58 X3.PWR
SCK  (via drill 0.35)  (4 unrouted)
  Top 0.508: GBA_CARTRIDGE.P$2 68.69,38.59
  Top 0.61: GBA_CARTRIDGE.P$2 68.62,41.8 76.35,49.53 78.74,49.53 83.82,54.61 J30.3
  Top 0.813: 68.62,33.96 GBA_CARTRIDGE.P$2
  Bottom 0.813: SWD.P2 81.28,26.92 v80.39,27.81
  Bottom 1.016: J30.1 J30.2 J30.3
SCL
  Top 0.61: GBA_CARTRIDGE.P$31 25.12,42.68 18.27,49.53 14.99,49.53 10.16,54.36 J1.3
  Bottom 1.016: J1.1 J1.2 J1.3
SDA
  Top 0.61: GBA_CARTRIDGE.P$30 26.62,42.46 17.77,51.31 15.75,51.31 12.7,54.36 J2.3
  Bottom 1.016: J2.1 J2.2 J2.3
SS
  Top 0.61: GBA_CARTRIDGE.P$5 64.12,42.79 76.2,54.86 J27.3
  Bottom 1.016: J27.1 J27.2 J27.3
VIN  (via drill 0.4)  (1 unrouted)
  Top 0.61: v92.71,44.7 91.96,45.45 REG_5V.3 C4.1 86.36,39.62 88.9,37.08 90.3,37.08 PC1.+ 90.3,35.43 90.81,34.92 v91.95,34.92
  Top 1.016: 90.17,34.92 90.3,35.05 | PC1.+ 90.3,35.05 | 90.42,34.92 90.3,35.05
  Bottom 0.813: T1.1 87.4,37.95 90.42,34.92 v91.95,34.92
  Bottom 1.016: v92.71,44.7 92.46,44.96 SJ1.1

### Text on the board
Top: Insert SoK here
tPlace: GND | SCL | SDA | D13 | D12 | D11 | D10 | D9 | D8 | D7 | D6 | D5 | D4 | D3 | D2 | D1 | D0 | A9 | A8 | A7 | A6 | A5 | A4 | A3 | A2 | A1 | A0 | SOK | MISO | MOSI | SCK | GND | GND | 3.3V | GND | VIN | !RESET | !RESET | 3.3V | SWDIO/TMS | GND | + | SWCLK/TCK | GND | SWO/TDO | KEY | NC/TDI | GND | !RESET | - | - | + | SoK Compatible / Host Device | NeKuNeKo / Inc. | ON/OFF
bPlace: 5.0V | SCL | SDA | D13 | D12 | D11 | D10 | D9 | D8 | D7 | D6 | D5 | D4 | D3 | D2 | D1 | D0 | A9 | A8 | A7 | A6 | A5 | A4 | A3 | A2 | A1 | A0 | SOK | MISO | MOSI | SCK | GND | GND | 3.3V | GND | GND | VIN | Rev. 3.0 / Jun. 2019 | - | 3.3V | SWDIO | + | GND | SWCLK | GND | SWO | NC | NC | GND | !RESET | - | + | OFF/ON
tNames: SISTEMA / ENCENDIDO | ON | 1 | ELV1 | ELV2 | 2 | ESTADO | INFO | Lluvia artificial / versión 3.0
tValues: Byron Jacquot
tFinish: SoK Breakout